# EAGLE design MRCS-CSNK (EAGLE 7.7.0)
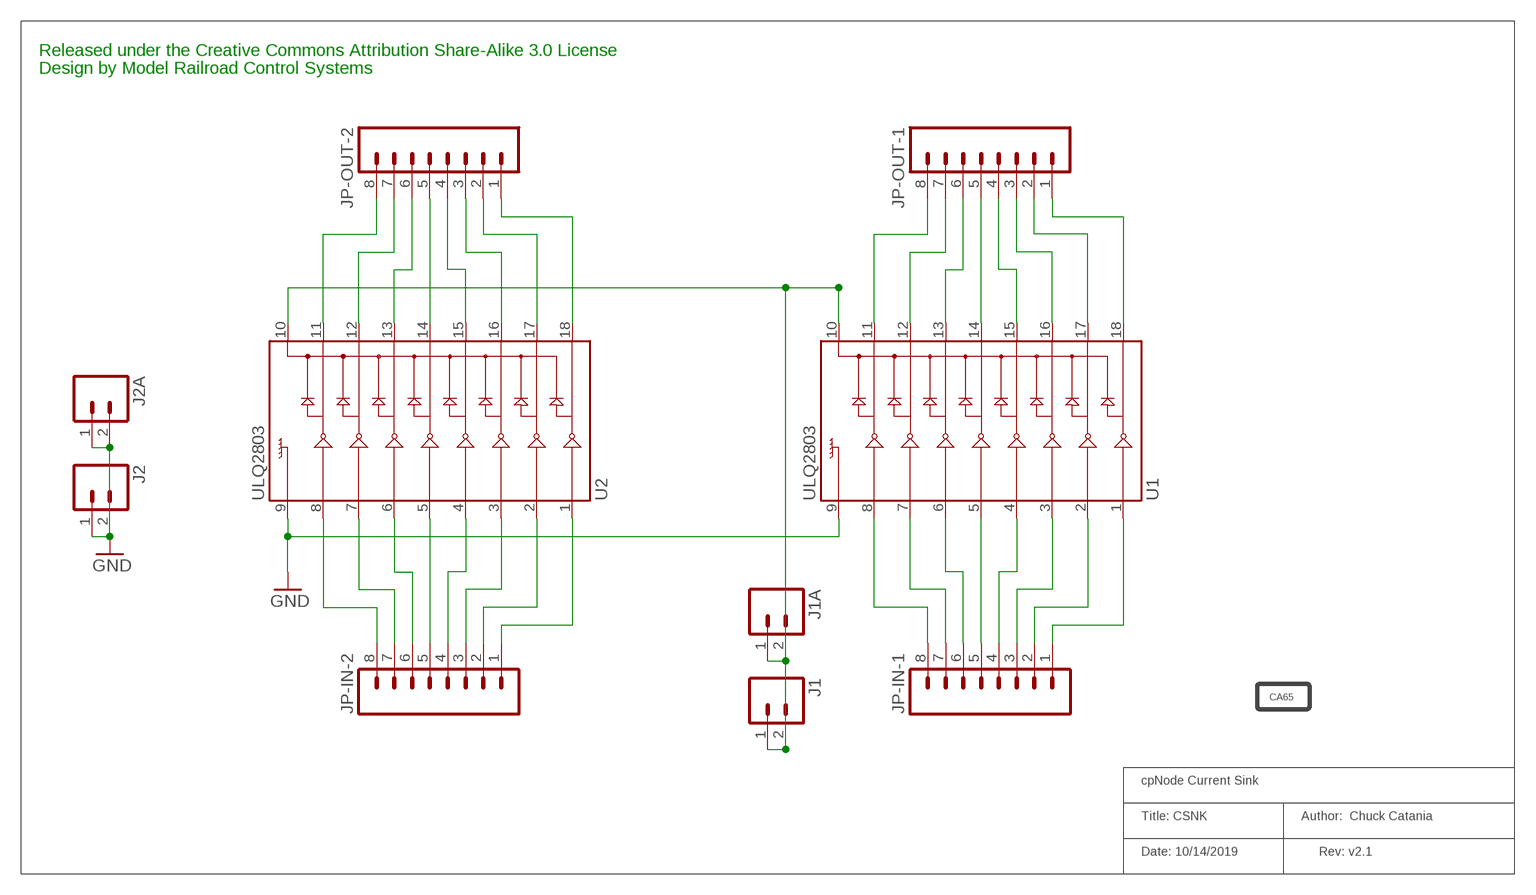
[diagram p0: schematic, sheet 1]

## Parts
J1  CONNECTOR-M021X02-LOCK  [1X02_LOCK]
J1A  CONNECTOR-M023.5MM-LOCK  [SCREWTERMINAL-3.5MM-2_LOCK]
J2  CONNECTOR-M021X02-LOCK  [1X02_LOCK]
J2A  CONNECTOR-M023.5MM-LOCK  [SCREWTERMINAL-3.5MM-2_LOCK]
JP-IN-1  CONNECTOR-M08LOCK  [1X08_LOCK]
JP-IN-2  CONNECTOR-M08LOCK  [1X08_LOCK]
JP-OUT-1  CONNECTOR-M08LOCK  [1X08_LOCK]
JP-OUT-2  CONNECTOR-M08LOCK  [1X08_LOCK]
PROP65  DOC-CA65B  [CA-PROP65-BACK]
U1  ULQ2803  ULN2803DIP  [DIL18]
U2  ULQ2803  ULN2803DIP  [DIL18]

## Nets
GND: J2.1(A) J2.2(B) J2A.1(A) J2A.2(B) U1.9 U2.9
N$1: JP-IN-1.1 U1.1
N$2: JP-IN-1.2 U1.2
N$3: JP-IN-1.3 U1.3
N$4: JP-IN-1.4 U1.4
N$5: JP-IN-1.5 U1.5
N$6: JP-IN-1.6 U1.6
N$7: JP-IN-1.7 U1.7
N$8: JP-IN-1.8 U1.8
N$9: JP-OUT-1.1 U1.18
N$10: JP-OUT-1.2 U1.17
N$11: JP-OUT-1.3 U1.16
N$12: JP-OUT-1.4 U1.15
N$13: JP-OUT-1.5 U1.14
N$14: JP-OUT-1.6 U1.13
N$15: JP-OUT-1.7 U1.12
N$16: JP-OUT-1.8 U1.11
N$17: JP-OUT-2.5 U2.14
N$19: JP-IN-2.1 U2.1
N$20: JP-IN-2.2 U2.2
N$21: JP-IN-2.3 U2.3
N$22: JP-IN-2.4 U2.4
N$23: JP-IN-2.5 U2.5
N$24: JP-IN-2.6 U2.6
N$25: JP-IN-2.7 U2.7
N$26: JP-IN-2.8 U2.8
N$28: JP-OUT-2.8 U2.11
N$29: JP-OUT-2.7 U2.12
N$30: JP-OUT-2.6 U2.13
N$31: JP-OUT-2.4 U2.15
N$32: JP-OUT-2.3 U2.16
N$33: JP-OUT-2.2 U2.17
N$34: JP-OUT-2.1 U2.18
N$37: J1.1(A) J1.2(B) J1A.1(A) J1A.2(B) U1.10 U2.10

## Notes on the sheet
- Released under the Creative Commons Attribution Share-Alike 3.0 License
- Design by Model Railroad Control Systems
- cpNode Current Sink
- Title: CSNK | Author:  Chuck Catania
- Date: 10/14/2019 | Rev: v2.1

## Library data of the parts
J1 J1A J2 J2A = SPCoast:CONNECTOR-M02: PHOENIX CONNECTOR
JP-IN-1 JP-IN-2 JP-OUT-1 JP-OUT-2 = SPCoast:CONNECTOR-M08: Header 8 Standard 8-pin 0.1" header. Use with straight break away headers (SKU : PRT-00116), right angle break away headers (PRT-00553), swiss pins (PRT-00743), machine pins (PRT-00117), and female headers (PRT-00115).
PROP65 = SPCoast:DOC-CA65
U1 U2 = SparkFun-PowerIC:ULN2803: Darlington Driver ULN2803 Darlington array. 500mA max per channel, 8-channel package. Spark Fun Electronics SKU : COM-00312

## Net classes
0 default: width 0.406 mm

## Board
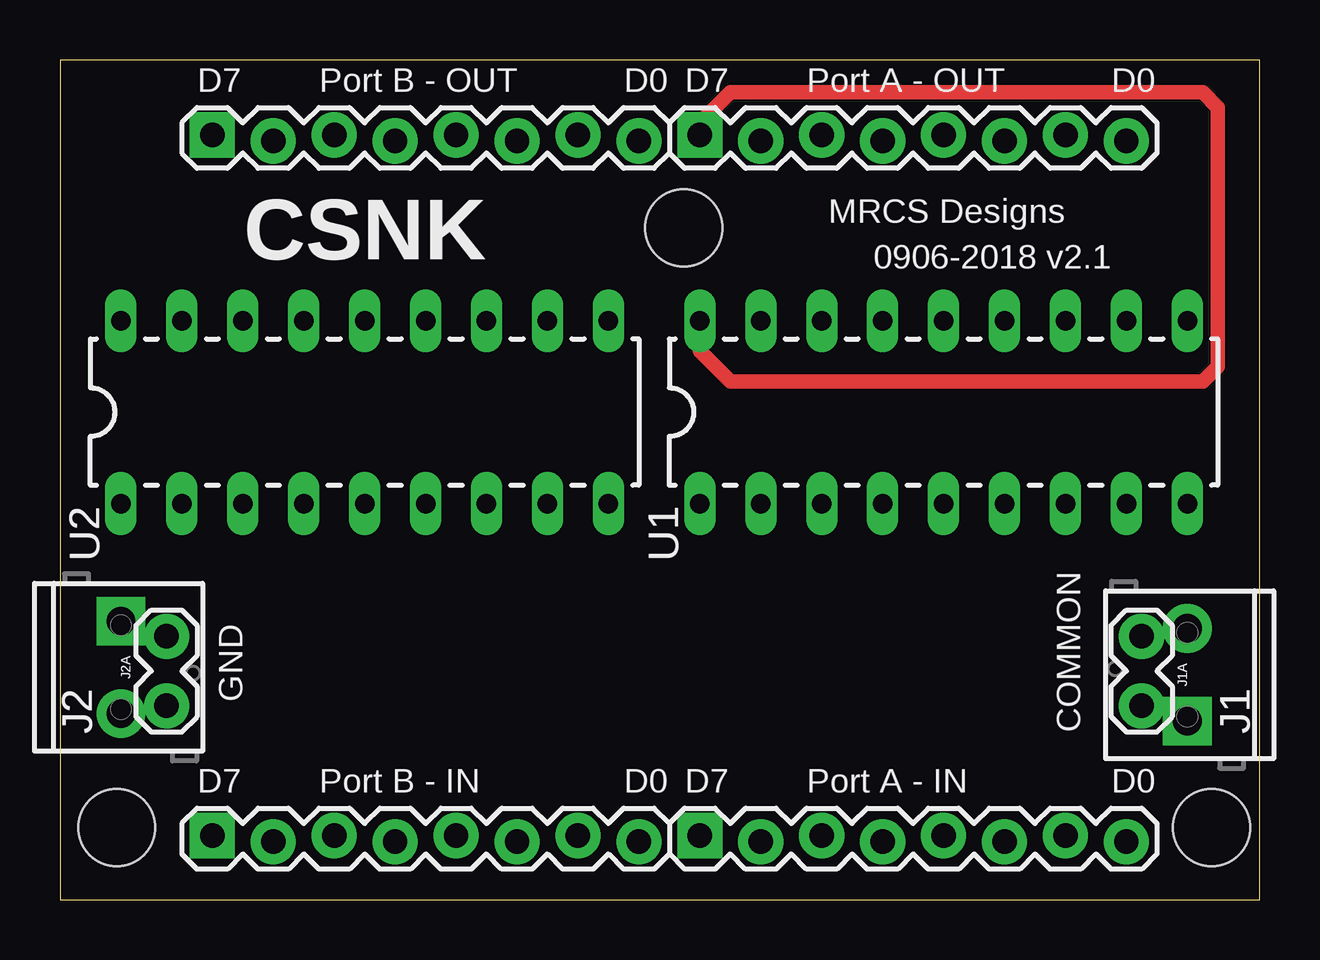
[diagram p1: board, top side]
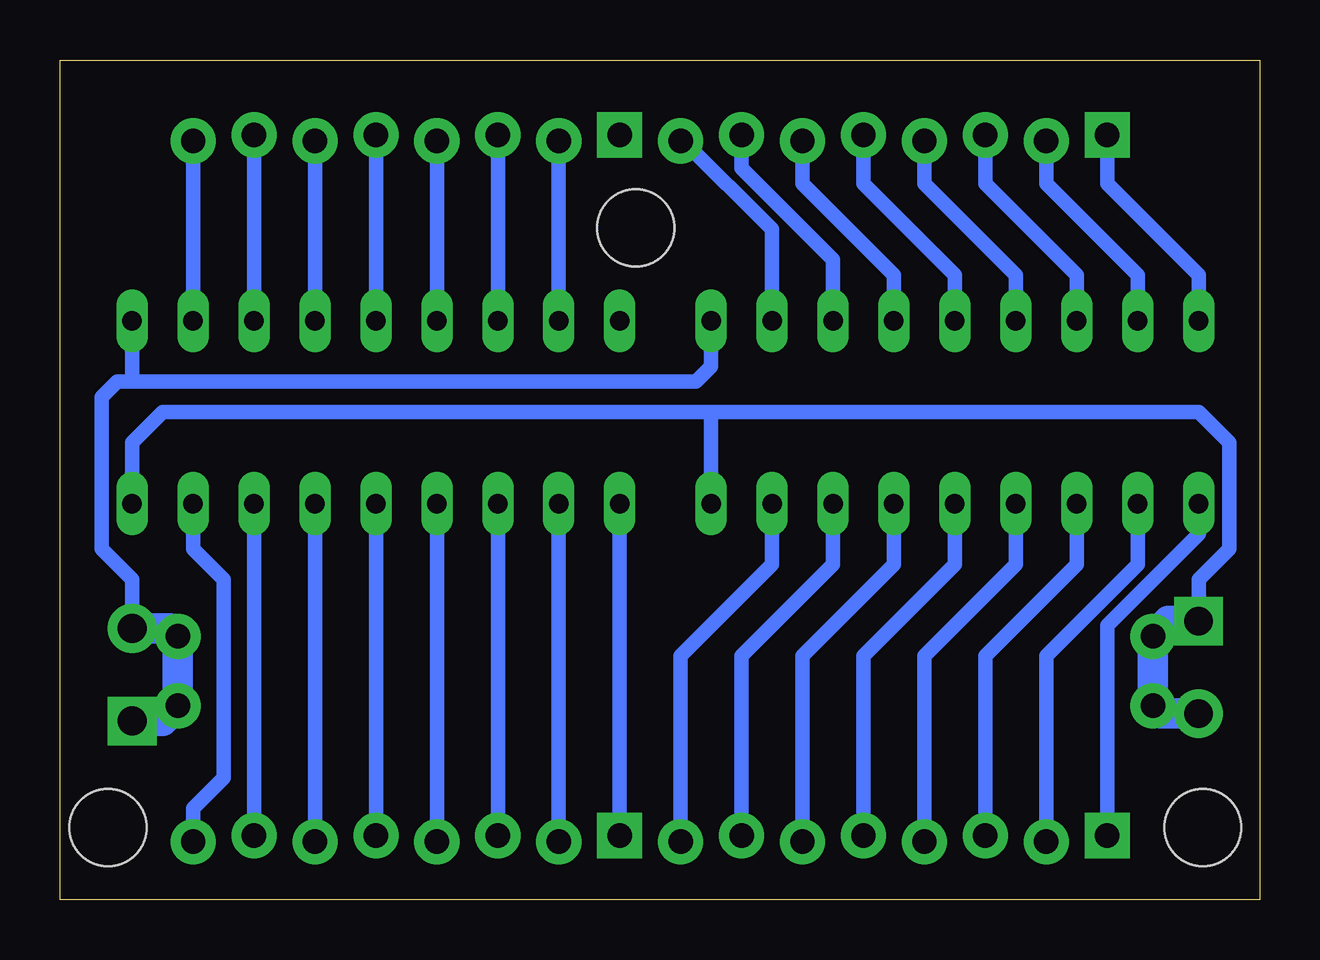
[diagram p2: board, bottom side, seen from below]

Size 50 x 35 mm. Coordinates in mm from the lower left corner, seen from the top.
Outline: 0,0 50,0 50,35 0,35 0,0
Copper layers (1*16): Top 0.035mm / dielectric 1.5mm / Bottom 0.035mm
Design rules "default": minimum track width 10mil, minimum drill 0.6mm, track to track 8mil, track to pad 8mil, pad to pad 8mil, via to via 8mil, smd to smd 8mil, copper to edge 40mil, drill to drill 8mil, minimum pad ring 10mil, minimum via ring 8mil, stop-mask expansion 4mil, vias tented up to drill 0mil, thermal gap 10mil
Holes 3.2 mm at 2.37,3 48,3 26,28

### Footprints (pad centres in the part's own frame; a part is rotated, then mirrored left to right if it is on the bottom)
1X02_LOCK = drill 1.016 pad 1.88: 1 -0.178,0; 2 2.718,0
SCREWTERMINAL-3.5MM-2_LOCK = drill 1.2 pad 2.032 square: 1 -0.178,0 | drill 1.2 pad 2.032: 2 3.678,0
1X08_LOCK = drill 1.016 pad 1.88 square: 1 0,0.127 | drill 1.016 pad 1.88: 2 2.54,-0.127; 3 5.08,0.127; 4 7.62,-0.127; 5 10.16,0.127; 6 12.7,-0.127; 7 15.24,0.127; 8 17.78,-0.127
DIL18 = drill 0.813 long: 1 -10.16,-3.81; 2 -7.62,-3.81; 3 -5.08,-3.81; 4 -2.54,-3.81; 5 0,-3.81; 6 2.54,-3.81; 7 5.08,-3.81; 8 7.62,-3.81; 9 10.16,-3.81; 10 10.16,3.81; 11 7.62,3.81; 12 5.08,3.81; 13 2.54,3.81; 14 0,3.81; 15 -2.54,3.81; 16 -5.08,3.81; 17 -7.62,3.81; 18 -10.16,3.81

### Placement (x,y rotation side)
J1  45.09,8.26 90 top
J1A  46.99,7.62 90 top
J2  4.45,8.26 90 top
J2A  2.54,11.43 270 top
JP-IN-1  26.67,2.54 0 top
JP-IN-2  6.35,2.54 0 top
JP-OUT-1  26.67,31.75 0 top
JP-OUT-2  6.35,31.75 0 top
PROP65  36.2,8.26 0 top
U1  36.83,20.32 0 top
U2  12.7,20.32 0 top

### Tracks (layer width: path | path; a pad name or v marks a point on that pad's centre or on a via)
GND
  Bottom 0.61: U1.9 46.99,19.05 45.72,20.32 22.86,20.32 | 22.86,20.32 U2.9 | 22.86,20.32 2.54,20.32 1.27,19.05 1.27,14.61 2.54,13.34 J2A.1
  Bottom 1.27: J2A.1 3.81,11.61 J2.2 J2.1 4.12,7.75 J2A.2
N$1
  Bottom 0.61: JP-IN-1.1 U1.1
N$2
  Bottom 0.61: JP-IN-1.2 U1.2
N$3
  Bottom 0.61: JP-IN-1.3 U1.3
N$4
  Bottom 0.61: JP-IN-1.4 U1.4
N$5
  Bottom 0.61: JP-IN-1.5 U1.5
N$6
  Bottom 0.61: JP-IN-1.6 U1.6
N$7
  Bottom 0.61: JP-IN-1.7 U1.7
N$8
  Bottom 0.61: U1.8 44.45,14.61 43.18,13.34 43.18,5.08 44.45,3.81 JP-IN-1.8
N$9
  Top 0.61: JP-OUT-1.1 26.67,32.38 27.94,33.66 47.62,33.66 48.26,33.02 48.26,22.23 47.62,21.59 27.94,21.59 26.67,22.86 U1.18
N$10
  Bottom 0.61: JP-OUT-1.2 U1.17
N$11
  Bottom 0.61: JP-OUT-1.3 U1.16
N$12
  Bottom 0.61: JP-OUT-1.4 U1.15
N$13
  Bottom 0.61: JP-OUT-1.5 U1.14
N$14
  Bottom 0.61: JP-OUT-1.6 U1.13
N$15
  Bottom 0.61: JP-OUT-1.7 U1.12
N$16
  Bottom 0.61: JP-OUT-1.8 U1.11
N$17
  Bottom 0.61: JP-OUT-2.5 16.51,29.84 12.7,26.04 U2.14
N$19
  Bottom 0.61: U2.1 2.54,15.24 6.35,11.43 JP-IN-2.1
N$20
  Bottom 0.61: U2.2 5.08,13.97 8.89,10.16 JP-IN-2.2
N$21
  Bottom 0.61: U2.3 7.62,13.97 11.43,10.16 JP-IN-2.3
N$22
  Bottom 0.61: U2.4 10.16,13.97 13.97,10.16 JP-IN-2.4
N$23
  Bottom 0.61: U2.5 12.7,13.97 16.51,10.16 JP-IN-2.5
N$24
  Bottom 0.61: U2.6 15.24,13.97 19.05,10.16 JP-IN-2.6
N$25
  Bottom 0.61: U2.7 17.78,13.97 21.59,10.16 JP-IN-2.7
N$26
  Bottom 0.61: U2.8 20.32,13.97 24.13,10.16 JP-IN-2.8
N$28
  Bottom 0.61: JP-OUT-2.8 24,31.62 20.32,27.94 U2.11
N$29
  Bottom 0.61: JP-OUT-2.7 21.59,30.48 17.78,26.67 U2.12
N$30
  Bottom 0.61: JP-OUT-2.6 19.05,29.84 15.24,26.04 U2.13
N$31
  Bottom 0.61: JP-OUT-2.4 13.97,29.84 10.16,26.04 U2.15
N$32
  Bottom 0.61: JP-OUT-2.3 11.43,29.84 7.62,26.04 U2.16
N$33
  Bottom 0.61: JP-OUT-2.2 8.89,29.84 5.08,26.04 U2.17
N$34
  Bottom 0.61: JP-OUT-2.1 6.35,29.84 2.54,26.04 U2.18
N$37
  Bottom 0.61: U2.10 22.86,22.23 23.5,21.59 46.99,21.59 | 46.99,21.59 47.62,21.59 48.26,20.95 48.26,14.61 46.99,13.34 J1A.2 | U1.10 46.99,21.59
  Bottom 1.27: J1A.2 45.41,11.3 J1.2 J1.1 45.72,7.44 J1A.1

### Text on the board
tPlace: D7 | Port B - OUT | D0 | D7 | Port A - OUT | D0 | CSNK | MRCS Designs | 0906-2018 v2.1 | GND | COMMON | D7 | Port B - IN | D0 | D7 | Port A - IN | D0
_tNames: U2 | U1 | J2A | J1A | J2 | J1